# Altium schematic sheet LNA.SchDoc
size B; Organization: MASA; SheetNumber: 2; SheetTotal: 6
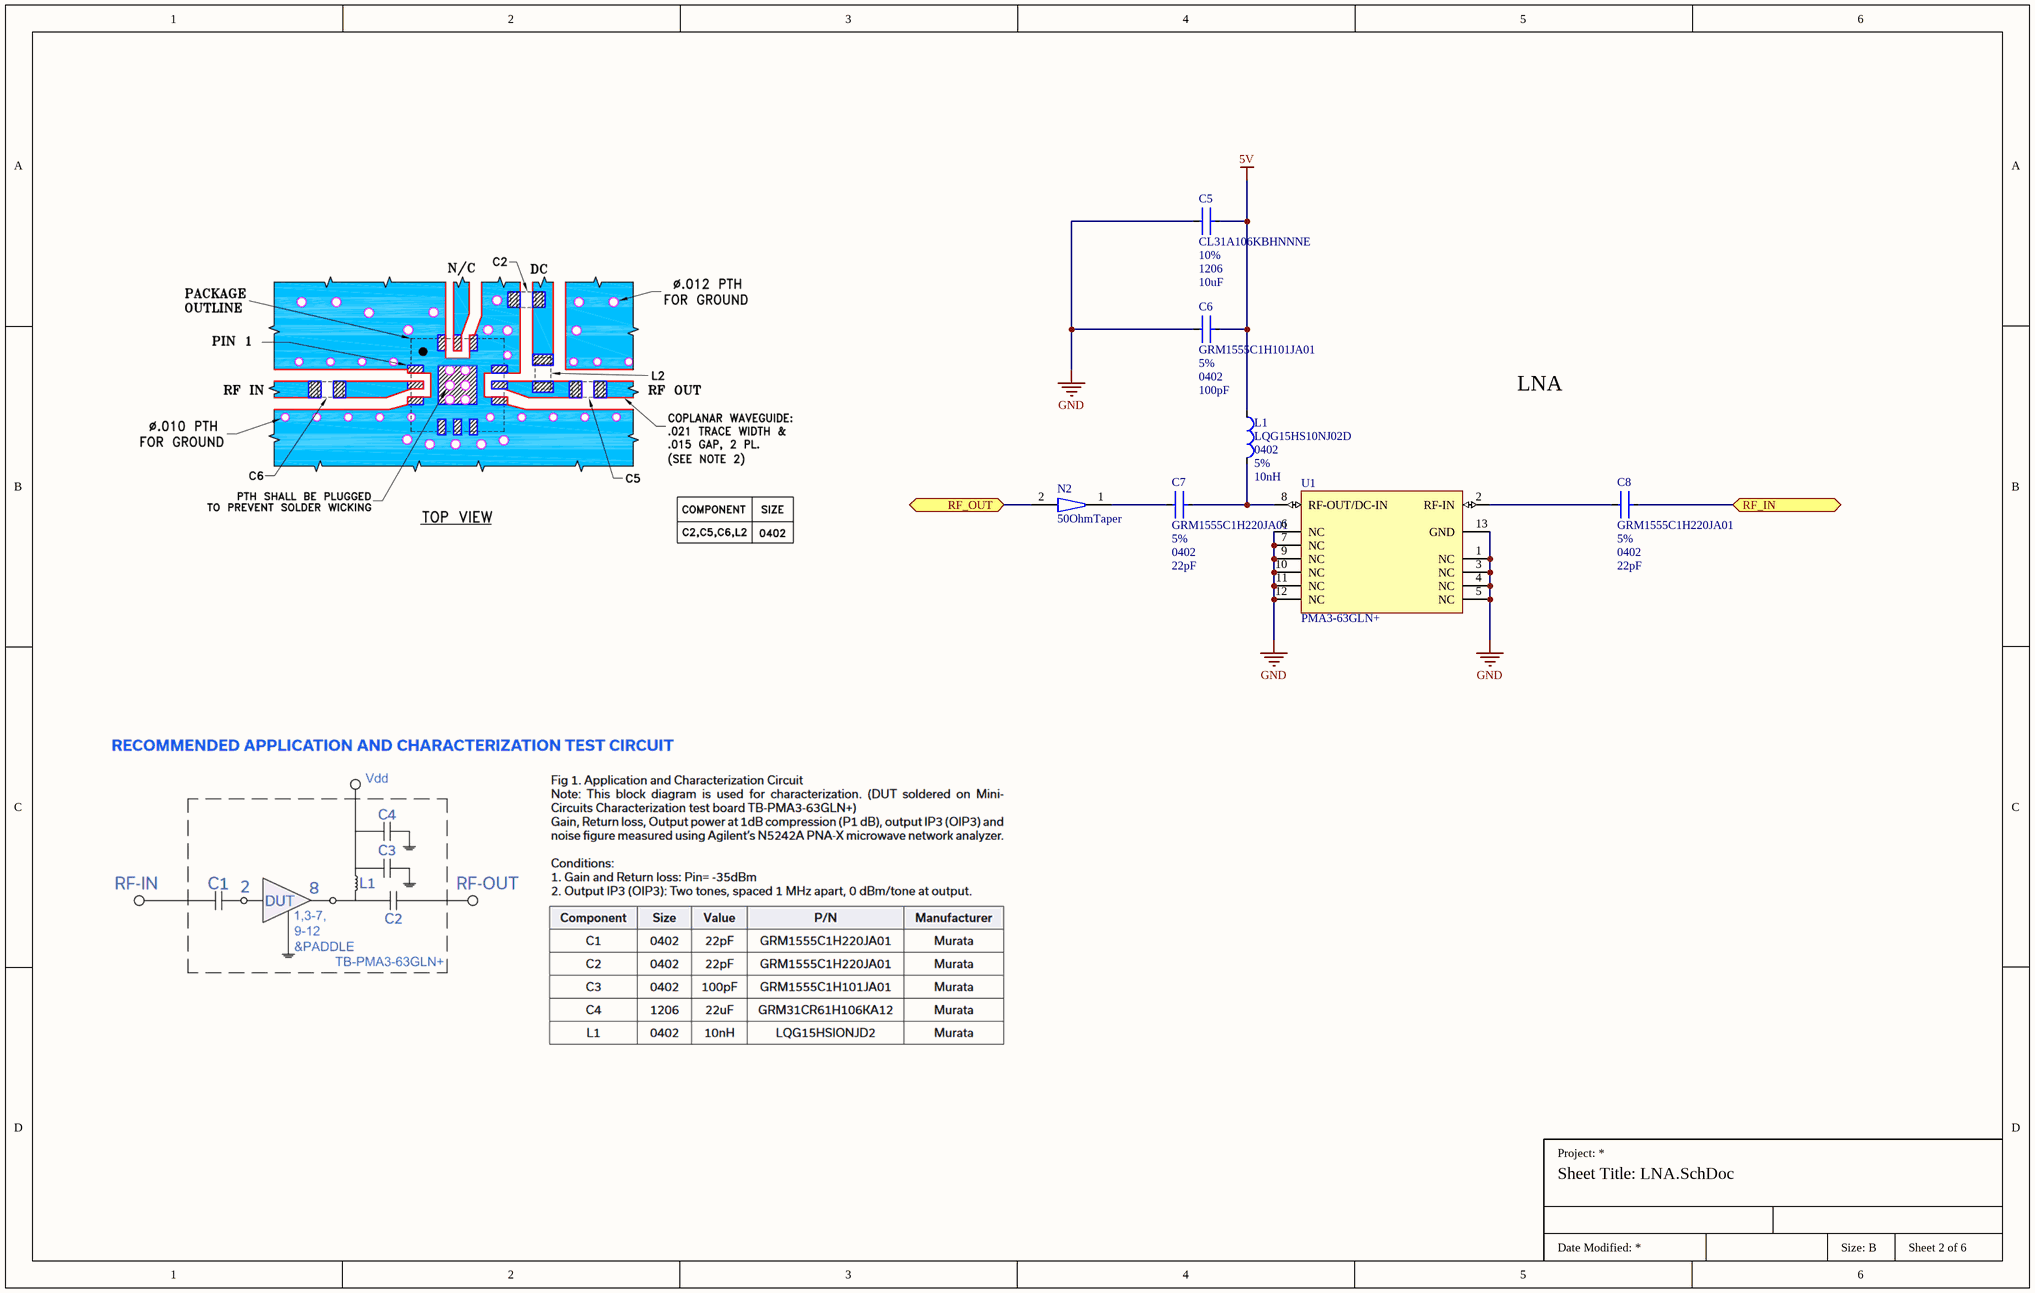
[diagram p0: LNA.SchDoc]

## Parts
C5  CL31A106KBHNNNE  value 10uF  Tolerance: 10%  Package: 1206  [Capactor1206_Samsung]
C6  GRM1555C1H101JA01  value 100pF  Tolerance: 5%  Package: 0402  [Capacitor0402_Murata]
C7  GRM1555C1H220JA01  value 22pF  Tolerance: 5%  Package: 0402  [Capacitor0402_Murata]
C8  GRM1555C1H220JA01  value 22pF  Tolerance: 5%  Package: 0402  [Capacitor0402_Murata]
L1  LQG15HS10NJ02D  Case Code (Imperial): 0402  Tolerance: 5%  Inductance: 10nH  [FP-LQG15HH_02-IPC_B]
N2  50OhmTaper  [50OhmTaper]  (net tie, no BOM)
U1  PMA3-63GLN+  [PMA3-63GLN+-QFN127P600-8N]

## Ports
RF_IN (bidir), RF_OUT (bidir)

## Nets
5V: C5.1 C6.1 L1.2
GND: C5.2 C6.2 U1.1(NC) U1.3(NC) U1.4(NC) U1.5(NC) U1.6(NC) U1.7(NC) U1.9(NC) U1.10(NC) U1.11(NC) U1.12(NC) U1.13(GND)
RF_IN: C8.1 ; port RF_IN
RF_OUT: N2.2 ; port RF_OUT
NetC7_1: C7.1 L1.1 U1.8(RF-OUT/DC-IN)
NetC7_2: C7.2 N2.1
NetC8_2: C8.2 U1.2(RF-IN)

## Notes on the sheet
- LNA
- Size: B

## Library data of the parts
C5 = CL31A106KBHNNNE: 10 µF ±10% 50V Ceramic Capacitor X5R 1206 (3216 Metric); Automotive Grade: Grade 1; RoHS: TRUE; Material: Ceramic; Temperature Range High: +125°C; Lead Free: Yes; Category: Cap; ComponentLink2Description: Datasheet; Temperature Range Low: -55°C; Device Class L1: Passive Components; Voltage Rating: 50 V; Automotive: Yes; Device Class L3: Ceramic Capacitors; ComponentLink2URL: https://api.kemet.com/component-edge/download/datasheet/C0603C100J5GACAUTO.pdf; Device Class L2: Capacitors; Temperature Characteristic: X5R; Supplier 1: Arrow Electronics; Supplier Part Number 1: CL31A106KBHNNNE
C6 = GRM1555C1H101JA01: 100 pF ±5% 50V Ceramic Capacitor C0G, NP0 0402 (1005 Metric); Automotive Grade: Grade 1; Temperature Characteristic: X7R; RoHS: TRUE; Material: Ceramic; Temperature Range High: +125°C; Lead Free: Yes; Category: Cap; ComponentLink2Description: Datasheet; Temperature Range Low: -55°C; Device Class L1: Passive Components; Voltage Rating: 50 V; Automotive: Yes; Device Class L3: Ceramic Capacitors; ComponentLink2URL: https://api.kemet.com/component-edge/download/datasheet/C0603C100J5GACAUTO.pdf; Device Class L2: Capacitors; Supplier 1: Avnet; Supplier Part Number 1: GRM1555C1H101JA01D
C7 C8 = GRM1555C1H220JA01: 22 pF ±5% 50V Ceramic Capacitor C0G, NP0 0402 (1005 Metric); Automotive Grade: Grade 1; Temperature Characteristic: X7R; RoHS: TRUE; Material: Ceramic; Temperature Range High: +125°C; Lead Free: Yes; Category: Cap; ComponentLink2Description: Datasheet; Temperature Range Low: -55°C; Device Class L1: Passive Components; Voltage Rating: 50 V; Automotive: Yes; Device Class L3: Ceramic Capacitors; ComponentLink2URL: https://api.kemet.com/component-edge/download/datasheet/C0603C100J5GACAUTO.pdf; Device Class L2: Capacitors; Supplier 1: Avnet; Supplier Part Number 1: GRM1555C1H220JA01D
L1 = LQG15HS10NJ02D: Multilayer type RF Inductor 10nH ±5% 0.26Ω 500mA 0402; DC Resistance (DCR): 260mR; DC Current: 300mA; Shielding: Unshielded; Q Factor: 8; Test Frequency: 100MHz; Self Resonant Frequency: 3.4GHz; Core Material: Air; Width: 0.5mm; Radiation Hardening: No; Packaging: Tape and Reel; Lead Free: Lead Free; Military Standard: Not; Case/Package: 0402; Current Rating: 300mA; Case Code (Metric): 1005; Length: 0.039inch; Termination: SMD/SMT; Max DC Current: 300mA; Max Operating Temperature: 125°C; Mount: Surface Mount; Height - Seated (Max): 0.022inch; Package Quantity: 10000; Height: 0.5mm; Depth: 0.55mm; Min Operating Temperature: -55°C; Supplier 1: Arrow Electronics; Supplier Part Number 1: LQG15HS10NJ02D
N2 = 50OhmTaper: Triangular taper from 50 Ohms to 0402 width
U1 = PMA3-63GLN+: RF Amplifier IC LTE, Radar, SATCOM, UMTS, WiFi, WiMAX, WLAN 1.8GHz ~ 6GHz 12-MCLP (3x3); Supplier 1: Digikey; Supplier Part Number 1: 3157-PMA3-63GLN+CT-ND